# Altium schematic sheet Power_&_Mechanical.SchDoc
size A4; CompanyName: imaginary Audio; Organization: imaginary Audio; Address1: 6903 101 Ave NW; Address2: Edmonton; Address3: AB; Address4: T6A 0H6; DocumentNumber: 4; Revision: 0.1; SheetNumber: 4; SheetTotal: 4; Designer: Gabriel Bessette
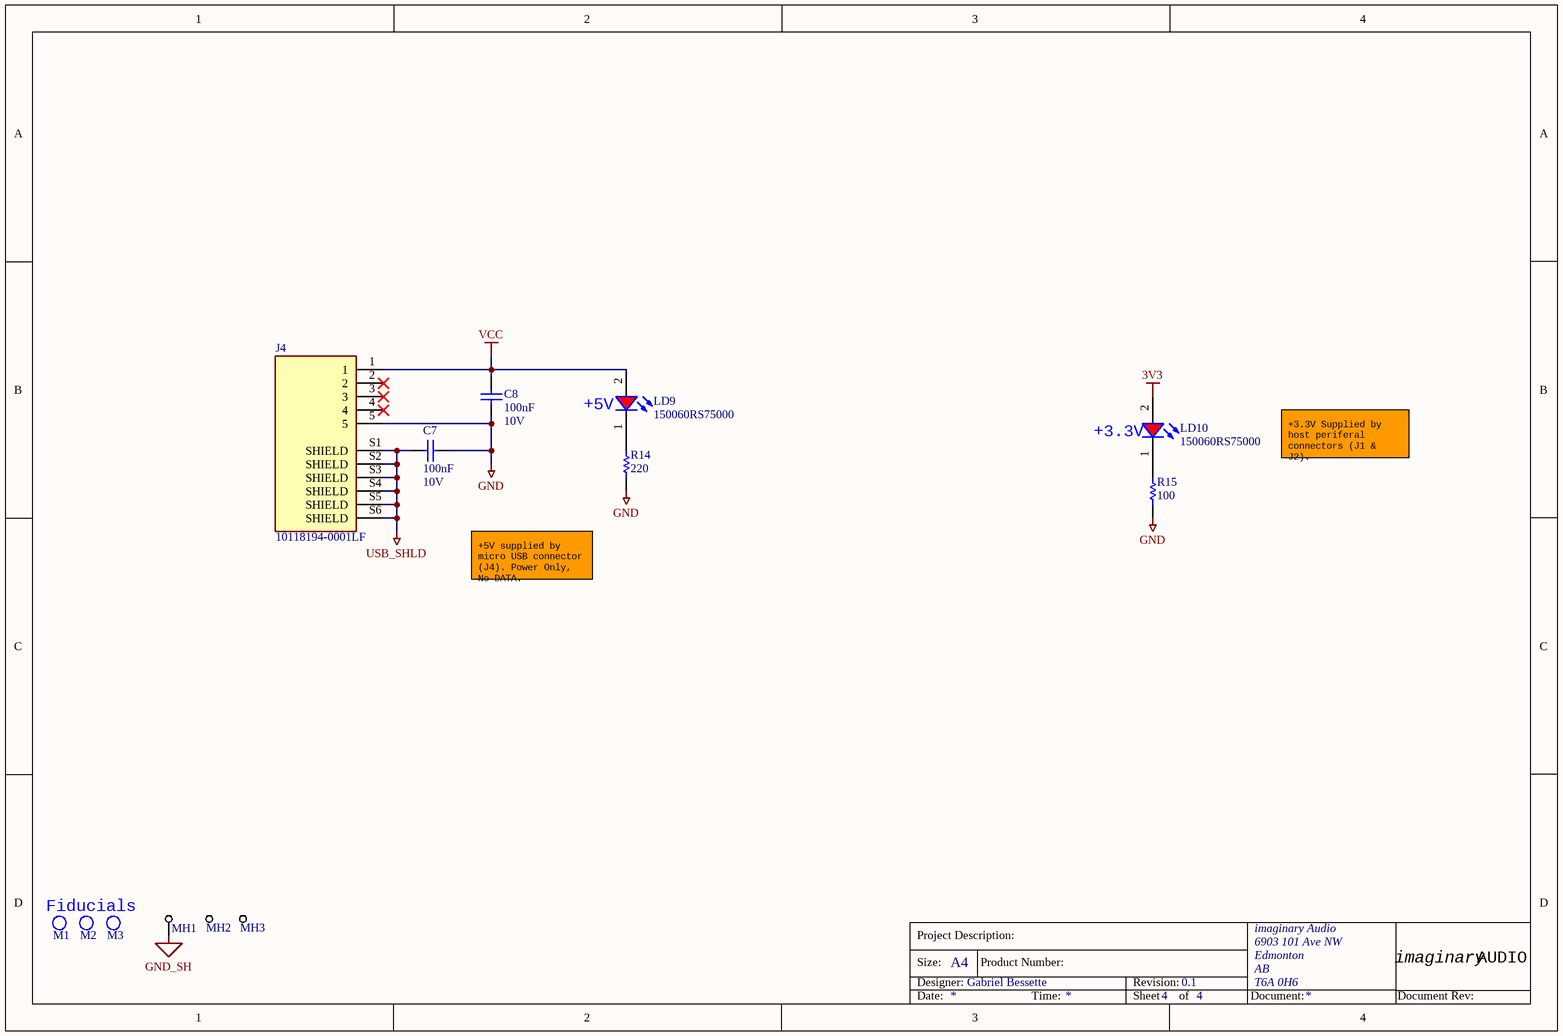
[diagram p0: Power_&_Mechanical.SchDoc]

## Parts
C7  100nF  Voltage: 10V  [CAPC0603(1608)100_N]
C8  100nF  Voltage: 10V  [CAPC0603(1608)100_N]
J4  10118194-0001LF  [10118194-0001LF]
LD9  150060RS75000  [WL-SMCW_0603_H=0.7mm]
LD10  150060RS75000  [WL-SMCW_0603_H=0.7mm]
M1  FIDUCIAL Marker, 1mm-2mm, 2-Layers + Keepout  [FIDUCIAL_D-2D_2-Layer]  (value not drawn)  (no BOM)
M2  FIDUCIAL Marker, 1mm-2mm, 2-Layers + Keepout  [FIDUCIAL_D-2D_2-Layer]  (value not drawn)  (no BOM)
M3  FIDUCIAL Marker, 1mm-2mm, 2-Layers + Keepout  [FIDUCIAL_D-2D_2-Layer]  (value not drawn)  (no BOM)
MH1  *  [MH_GND_M3]  (value not drawn)  (no BOM)
MH2  *  [MH_M3_NPTH]  (value not drawn)  (no BOM)
MH3  *  [MH_M3_NPTH]  (value not drawn)  (no BOM)
R14  220  [RESC1608X55X30NL15T15]
R15  100  [RESC1608X55X30NL15T15]

## Nets
3V3: LD10.2(A)
GND: C7.1 C8.1 J4.5 R14.1 R15.1
GND_SH: MH1.1
USB_SHLD: C7.2 J4.S1(SHIELD) J4.S2(SHIELD) J4.S3(SHIELD) J4.S4(SHIELD) J4.S5(SHIELD) J4.S6(SHIELD)
VCC: C8.2 J4.1 LD9.2(A)
NetLD9_1: LD9.1(K) R14.2
NetLD10_1: LD10.1(K) R15.2

Not connected (* = marked no-connect by the designer): J4 2* 3* 4*

## Notes on the sheet
- (near LD9) +5V
- (near LD10) +3.3V
- +3.3V Supplied by host periferal connectors (J1 & J2).
- +5V supplied by micro USB connector (J4). Power Only, No DATA.
- Fiducials
- Project Description:
- Size:
- Designer:
- A4
- Product Number:
- Revision:
- imaginary
- AUDIO
- Date:
- Time:
- Sheet
- of
- Document:
- Document Rev:

## Library data of the parts
C7 C8 = CAP: KEMET - C0603C104K8RACTU - SMD Multilayer Ceramic Capacitor, 0.1 µF, 10 V, 0603 [1608 Metric], ± 10%, X7R, C Series KEMET; Dissipation Factor: 5%; Max Thickness: 1 mm; Value: 100nF; Technology: SMT; Supplier 1: Digi-Key; Supplier Part Number 1: 399-1095-1-ND; Manufacturer: KEMET; Manufacturer Part Number: C0603C104K8RACTU; RoHS: Yes; Category: Ceramic Capacitors; Stock 1: 795093; Pricing 1: 1=0.12000, 10=0.08500, 50=0.04860, 100=0.04020, 500=0.02818, 1000=0.02333 (USD); Mount: Surface Mount,PCB; Case/Package: 0603; Number of Pins: 2; Case Code (Imperial): 0603; Case Code (Metric): 1608; Contact Plating: Tin,Matte; Dielectric Material: Ceramic; Min Operating Temperature: -55°C; Max Operating Temperature: 125°C; Capacitance: 100nF; Tolerance: 10%; Voltage Rating: 10V; Packaging: Tape and Reel; Package Quantity: 1; Voltage Rating (DC): 10V; Dielectric: X7R; Termination: SMD/SMT; Length: 1.6mm; Height: 0.8mm; Width: 0.8mm; Lead Pitch: 0.7mm; Thickness: 0.034inch; Depth: 0.8mm; Radiation Hardening: No; REACH SVHC: No SVHC; ComponentLink1URL: https://datasheet.ciiva.com/6093/1776114-6093269.pdf?src-supplier=Farnell; ComponentLink1Description: https://datasheet.ciiva.com/6093/1776114-6093269.pdf?src-supplier=Farnell; ComponentLink2URL: https://datasheet.ciiva.com/7823/kem-c1002-x7r-smd-7823989.pdf?src-supplier=Element14; ComponentLink2Description: https://datasheet.ciiva.com/7823/kem-c1002-x7r-smd-7823989.pdf?src-supplier=Element14; ComponentLink3URL: https://datasheet.ciiva.com/18192/getdatasheetpartid-91529-18192711.pdf?src-supplier=Verical; ComponentLink3Description: https://datasheet.ciiva.com/18192/getdatasheetpartid-91529-18192711.pdf?src-supplier=Verical; ComponentLink4URL: https://datasheet.ciiva.com/5419/kem-c1002-x7r-smd-357932-5419657.pdf?src-supplier=Mouser; ComponentLink4Description: https://datasheet.ciiva.com/5419/kem-c1002-x7r-smd-357932-5419657.pdf?src-supplier=Mouser; ComponentLink5URL: https://datasheet.ciiva.com/14589/70095383-14589402.pdf?src-supplier=Allied+Electronics; ComponentLink5Description: https://datasheet.ciiva.com/14589/70095383-14589402.pdf?src-supplier=Allied+Electronics; ComponentLink6URL: https://datasheet.ciiva.com/14593/70095383-14593978.pdf?src-supplier=Allied+Electronics; ComponentLink6Description: https://datasheet.ciiva.com/14593/70095383-14593978.pdf?src-supplier=Allied+Electronics
J4 = 10118194-0001LF: CONN, USB MICRO B RECPT SMT R/A; Manufacturer: Amphenol FCI; MF: Amphenol ICC; Gender: Receptacle; Current Rating: 1.8A; Connector Type: USB,Receptacle; Number of Contacts: 5; Insulation Resistance: 1GR; Number of Ports: 1; Max Voltage Rating (AC): 100V; Pitch: 0.65mm; Package: None; Price: None; Availability: Unavailable; MP: 10118194-0001LF; SnapEDA_Link: https://www.snapeda.com/parts/10118194-0001LF/Amphenol%20FCI/view-part/1413308/?ref=snap; Value: *; Supplier 1: Digi-Key; Supplier Part Number 1: 609-4618-1-ND; RoHS: Yes; Category: USB Connectors; Stock 1: 848; Pricing 1: 1=0.45000, 10=0.43000, 25=0.36840, 50=0.31320, 100=0.30090, 250=0.27016, 500=0.25788 (USD); Mount: Surface Mount,Horizontal; Color: Black; Contact Material: Copper Alloy; Contact Plating: Gold; Number of Terminals: 5; Housing Material: Polymer; Min Operating Temperature: -55°C; Max Operating Temperature: 85°C; Package Quantity: 9600; Packaging: Tape and Reel; Termination: Solder; Orientation: Right Angle; Features: Shielded; Length: 8.05mm; Depth: 5mm; Radiation Hardening: No; Lead Free: Lead Free; Flammability Rating: UL94 V-0; ComponentLink1URL: https://datasheet.ciiva.com/4598/10118194ac-197217-4598807.pdf?src-supplier=Mouser; ComponentLink1Description: https://datasheet.ciiva.com/4598/10118194ac-197217-4598807.pdf?src-supplier=Mouser; ComponentLink2URL: https://datasheet.ciiva.com/26945/getdatasheetpartid-418619-26945695.pdf?src-supplier=Verical; ComponentLink2Description: https://datasheet.ciiva.com/26945/getdatasheetpartid-418619-26945695.pdf?src-supplier=Verical; ComponentLink3URL: https://datasheet.ciiva.com/851/10118194-851110.pdf?src-supplier=Digi-Key; ComponentLink3Description: https://datasheet.ciiva.com/851/10118194-851110.pdf?src-supplier=Digi-Key; ComponentLink4URL: https://datasheet.ciiva.com/851/10118194-851111.pdf?src-supplier=Digi-Key; ComponentLink4Description: https://datasheet.ciiva.com/851/10118194-851111.pdf?src-supplier=Digi-Key; Supplier 2: Mouser; Supplier Part Number 2: 649-10118194-0001LF; Manufacturer Part Number: 10118194-0001LF
LD9 LD10 = 150060RS75000: LED, Red, 625 nm, 2 V, 30 mA, 250 mcd RoHS Compliant; Manufacturer: Wurth Electronics; Viewing Angle: 140°; Lens Style: Clear,Rectangular; Luminous Intensity: 250mcd; Forward Current: 30mA; Forward Voltage: 2V; Wavelength: 625nm; Test Current: 20mA; Supplier 1: Digi-Key; Supplier Part Number 1: 732-4978-1-ND; RoHS: Yes; Category: LEDs; Stock 1: 172283; Pricing 1: 1=0.14000, 50=0.13300, 100=0.11400, 500=0.09900 (USD); Mount: Surface Mount; Case/Package: 0603; Color: Red; Case Code (Metric): 1608; Case Code (Imperial): 0603; Min Operating Temperature: -40°C; Max Operating Temperature: 85°C; Package Quantity: 1; Packaging: Cut Tape; Dominant Wavelength: 625nm; Length: 1.6mm; Width: 0.8mm; Height: 0.7mm; REACH SVHC: Unknown; ComponentLink1URL: https://datasheet.ciiva.com/29563/150060rs75000-29563040.pdf?src-supplier=Digi-Key; ComponentLink1Description: https://datasheet.ciiva.com/29563/150060rs75000-29563040.pdf?src-supplier=Digi-Key; ComponentLink2URL: https://datasheet.ciiva.com/29279/759428-da-01-en-chipled-0603-w-kl-rot-150060rs75000-29279196.pdf?src-supplier=Conrad; ComponentLink2Description: https://datasheet.ciiva.com/29279/759428-da-01-en-chipled-0603-w-kl-rot-150060rs75000-29279196.pdf?src-supplier=Conrad; Manufacturer Part Number: 150060RS75000
M1-M3 = FIDUCIAL_D-2D_2L
MH1 = MountingHole_GND: Mounting Hole, Grounded, Generic; Manufacturer Part Number: *
MH2 MH3 = MountingHole: Mounting Hole, Generic; Manufacturer Part Number: *
R14 = RES: Resistor Thick Film 0603 220 Ohm 1% 1/10W 100ppm/C Molded SMD Punched Carrier T/R; Manufacturer Part Number: ERJ3EKF2200V; Resistance: 220R; Temperature Coefficient: 100ppm/°C; Power Rating: 100mW; Voltage Rating: 75V; Value: 220; Supplier 1: Digi-Key; Supplier Part Number 1: P220HCT-ND; RoHS: Yes; Category: Chip SMD Resistors; Stock 1: 200837; Pricing 1: 1=0.10000, 10=0.03200, 100=0.01300, 1000=0.00583, 2500=0.00506 (USD); Mount: Surface Mount; Case/Package: 0603; Number of Pins: 2; Contact Plating: Tin; Case Code (Metric): 1608; Case Code (Imperial): 0603; Weight: 7.1E-05oz; Min Operating Temperature: -55°C; Max Operating Temperature: 155°C; Tolerance: 1%; Resistor Type: Thick Film; Packaging: Tape and Reel; Package Quantity: 5000; Number of Terminations: 2; Termination: SMD/SMT; Max Power Dissipation: 100mW; Voltage Rating (DC): 75V; Features: Automotive AEC-Q200; Length: 1.6mm; Width: 0.8mm; Height: 0.45mm; Depth: 0.8mm; Radiation Hardening: No; REACH SVHC: No SVHC; Military Standard: Not; Lead Free: Lead Free; ComponentLink1URL: https://datasheet.ciiva.com/16511/aoa0000ce2-16511653.pdf?src-supplier=Avnet+Asia; ComponentLink1Description: https://datasheet.ciiva.com/16511/aoa0000ce2-16511653.pdf?src-supplier=Avnet+Asia; ComponentLink2URL: https://datasheet.ciiva.com/16784/70260748-16784374.pdf?src-supplier=Allied+Electronics; ComponentLink2Description: https://datasheet.ciiva.com/16784/70260748-16784374.pdf?src-supplier=Allied+Electronics; ComponentLink3URL: https://datasheet.ciiva.com/28568/1678782-28568854.pdf?src-supplier=Element14; ComponentLink3Description: https://datasheet.ciiva.com/28568/1678782-28568854.pdf?src-supplier=Element14; ComponentLink4URL: https://datasheet.ciiva.com/7886/aoa0000ce2-7886727.pdf?src-supplier=Element14; ComponentLink4Description: https://datasheet.ciiva.com/7886/aoa0000ce2-7886727.pdf?src-supplier=Element14; ComponentLink5URL: https://datasheet.ciiva.com/24161/aoa0000ce2-24161898.pdf?src-supplier=Mouser; ComponentLink5Description: https://datasheet.ciiva.com/24161/aoa0000ce2-24161898.pdf?src-supplier=Mouser; ComponentLink6URL: https://datasheet.ciiva.com/9184/aoa0000ce2-9184299.pdf?src-supplier=Avnet; ComponentLink6Description: https://datasheet.ciiva.com/9184/aoa0000ce2-9184299.pdf?src-supplier=Avnet; ComponentLink7URL: https://datasheet.ciiva.com/46372/1678782-46372844.pdf?src-supplier=Element14; ComponentLink7Description: https://datasheet.ciiva.com/46372/1678782-46372844.pdf?src-supplier=Element14; ComponentLink8URL: https://datasheet.ciiva.com/46372/1678782-46372845.pdf?src-supplier=Element14; ComponentLink8Description: https://datasheet.ciiva.com/46372/1678782-46372845.pdf?src-supplier=Element14; ComponentLink9URL: https://datasheet.ciiva.com/6138/aoa0000ce2-6138702.pdf?src-supplier=Farnell; ComponentLink9Description: https://datasheet.ciiva.com/6138/aoa0000ce2-6138702.pdf?src-supplier=Farnell; ComponentLink10URL: https://datasheet.ciiva.com/16773/70260748-16773054.pdf?src-supplier=Allied+Electronics; ComponentLink10Description: https://datasheet.ciiva.com/16773/70260748-16773054.pdf?src-supplier=Allied+Electronics; ComponentLink11URL: https://datasheet.ciiva.com/17206/aoa0000ce2-17206831.pdf?src-supplier=Avnet+Europe; ComponentLink11Description: https://datasheet.ciiva.com/17206/aoa0000ce2-17206831.pdf?src-supplier=Avnet+Europe
R15 = RES: RES SMD 100 OHM 1% 1/10W 0603; Manufacturer Part Number: ERJ3EKF1000V; Resistance: 100R; Temperature Coefficient: 100ppm/°C; Power Rating: 100mW; Voltage Rating: 75V; Value: 100; Supplier 1: Digi-Key; Supplier Part Number 1: P100HCT-ND; RoHS: Yes; Category: Chip SMD Resistors; Stock 1: 146769; Pricing 1: 1=0.10000, 10=0.03200, 100=0.01300, 1000=0.00583, 2500=0.00506 (USD); Mount: Surface Mount; Case/Package: 0603; Number of Pins: 2; Contact Plating: Tin; Case Code (Imperial): 0603; Case Code (Metric): 1608; Weight: 7.1E-05oz; Min Operating Temperature: -55°C; Max Operating Temperature: 155°C; Tolerance: 1%; Resistor Type: Thick Film; Packaging: Tape and Reel; Package Quantity: 5000; Termination: SMD/SMT; Number of Terminations: 2; Max Power Dissipation: 100mW; Voltage Rating (DC): 75V; Features: Automotive AEC-Q200; Length: 1.6mm; Width: 0.8mm; Height: 0.45mm; Depth: 0.8mm; Radiation Hardening: No; REACH SVHC: No SVHC; Military Standard: Not; Lead Free: Lead Free; ComponentLink1URL: https://datasheet.ciiva.com/34303/1987450-34303565.pdf?src-supplier=Jameco; ComponentLink1Description: https://datasheet.ciiva.com/34303/1987450-34303565.pdf?src-supplier=Jameco; ComponentLink2URL: https://datasheet.ciiva.com/9186/aoa0000ce2-9186725.pdf?src-supplier=Avnet; ComponentLink2Description: https://datasheet.ciiva.com/9186/aoa0000ce2-9186725.pdf?src-supplier=Avnet; ComponentLink3URL: https://datasheet.ciiva.com/16765/70260748-16765766.pdf?src-supplier=Allied+Electronics; ComponentLink3Description: https://datasheet.ciiva.com/16765/70260748-16765766.pdf?src-supplier=Allied+Electronics; ComponentLink4URL: https://datasheet.ciiva.com/46372/1678782-46372726.pdf?src-supplier=Element14; ComponentLink4Description: https://datasheet.ciiva.com/46372/1678782-46372726.pdf?src-supplier=Element14; ComponentLink5URL: https://datasheet.ciiva.com/30088/aoa0000ce2-30088649.pdf?src-supplier=Onlinecomponents.com; ComponentLink5Description: https://datasheet.ciiva.com/30088/aoa0000ce2-30088649.pdf?src-supplier=Onlinecomponents.com; ComponentLink6URL: https://datasheet.ciiva.com/48530/aoa0000ce2-48530986.pdf?src-supplier=Avnet; ComponentLink6Description: https://datasheet.ciiva.com/48530/aoa0000ce2-48530986.pdf?src-supplier=Avnet; ComponentLink7URL: https://datasheet.ciiva.com/17207/aoa0000ce2-17207983.pdf?src-supplier=Avnet+Europe; ComponentLink7Description: https://datasheet.ciiva.com/17207/aoa0000ce2-17207983.pdf?src-supplier=Avnet+Europe; ComponentLink8URL: https://datasheet.ciiva.com/46372/1678782-46372727.pdf?src-supplier=Element14; ComponentLink8Description: https://datasheet.ciiva.com/46372/1678782-46372727.pdf?src-supplier=Element14; ComponentLink9URL: https://datasheet.ciiva.com/7830/aoa0000ce2-7830728.pdf?src-supplier=Element14; ComponentLink9Description: https://datasheet.ciiva.com/7830/aoa0000ce2-7830728.pdf?src-supplier=Element14; ComponentLink10URL: https://datasheet.ciiva.com/24159/aoa0000ce2-24159753.pdf?src-supplier=Mouser; ComponentLink10Description: https://datasheet.ciiva.com/24159/aoa0000ce2-24159753.pdf?src-supplier=Mouser; ComponentLink11URL: https://datasheet.ciiva.com/16762/70260748-16762666.pdf?src-supplier=Allied+Electronics; ComponentLink11Description: https://datasheet.ciiva.com/16762/70260748-16762666.pdf?src-supplier=Allied+Electronics; ComponentLink12URL: https://datasheet.ciiva.com/22667/1678782-22667887.pdf?src-supplier=Element14; ComponentLink12Description: https://datasheet.ciiva.com/22667/1678782-22667887.pdf?src-supplier=Element14